# EAGLE design 1x9 to 1x9 (EAGLE 6.4)
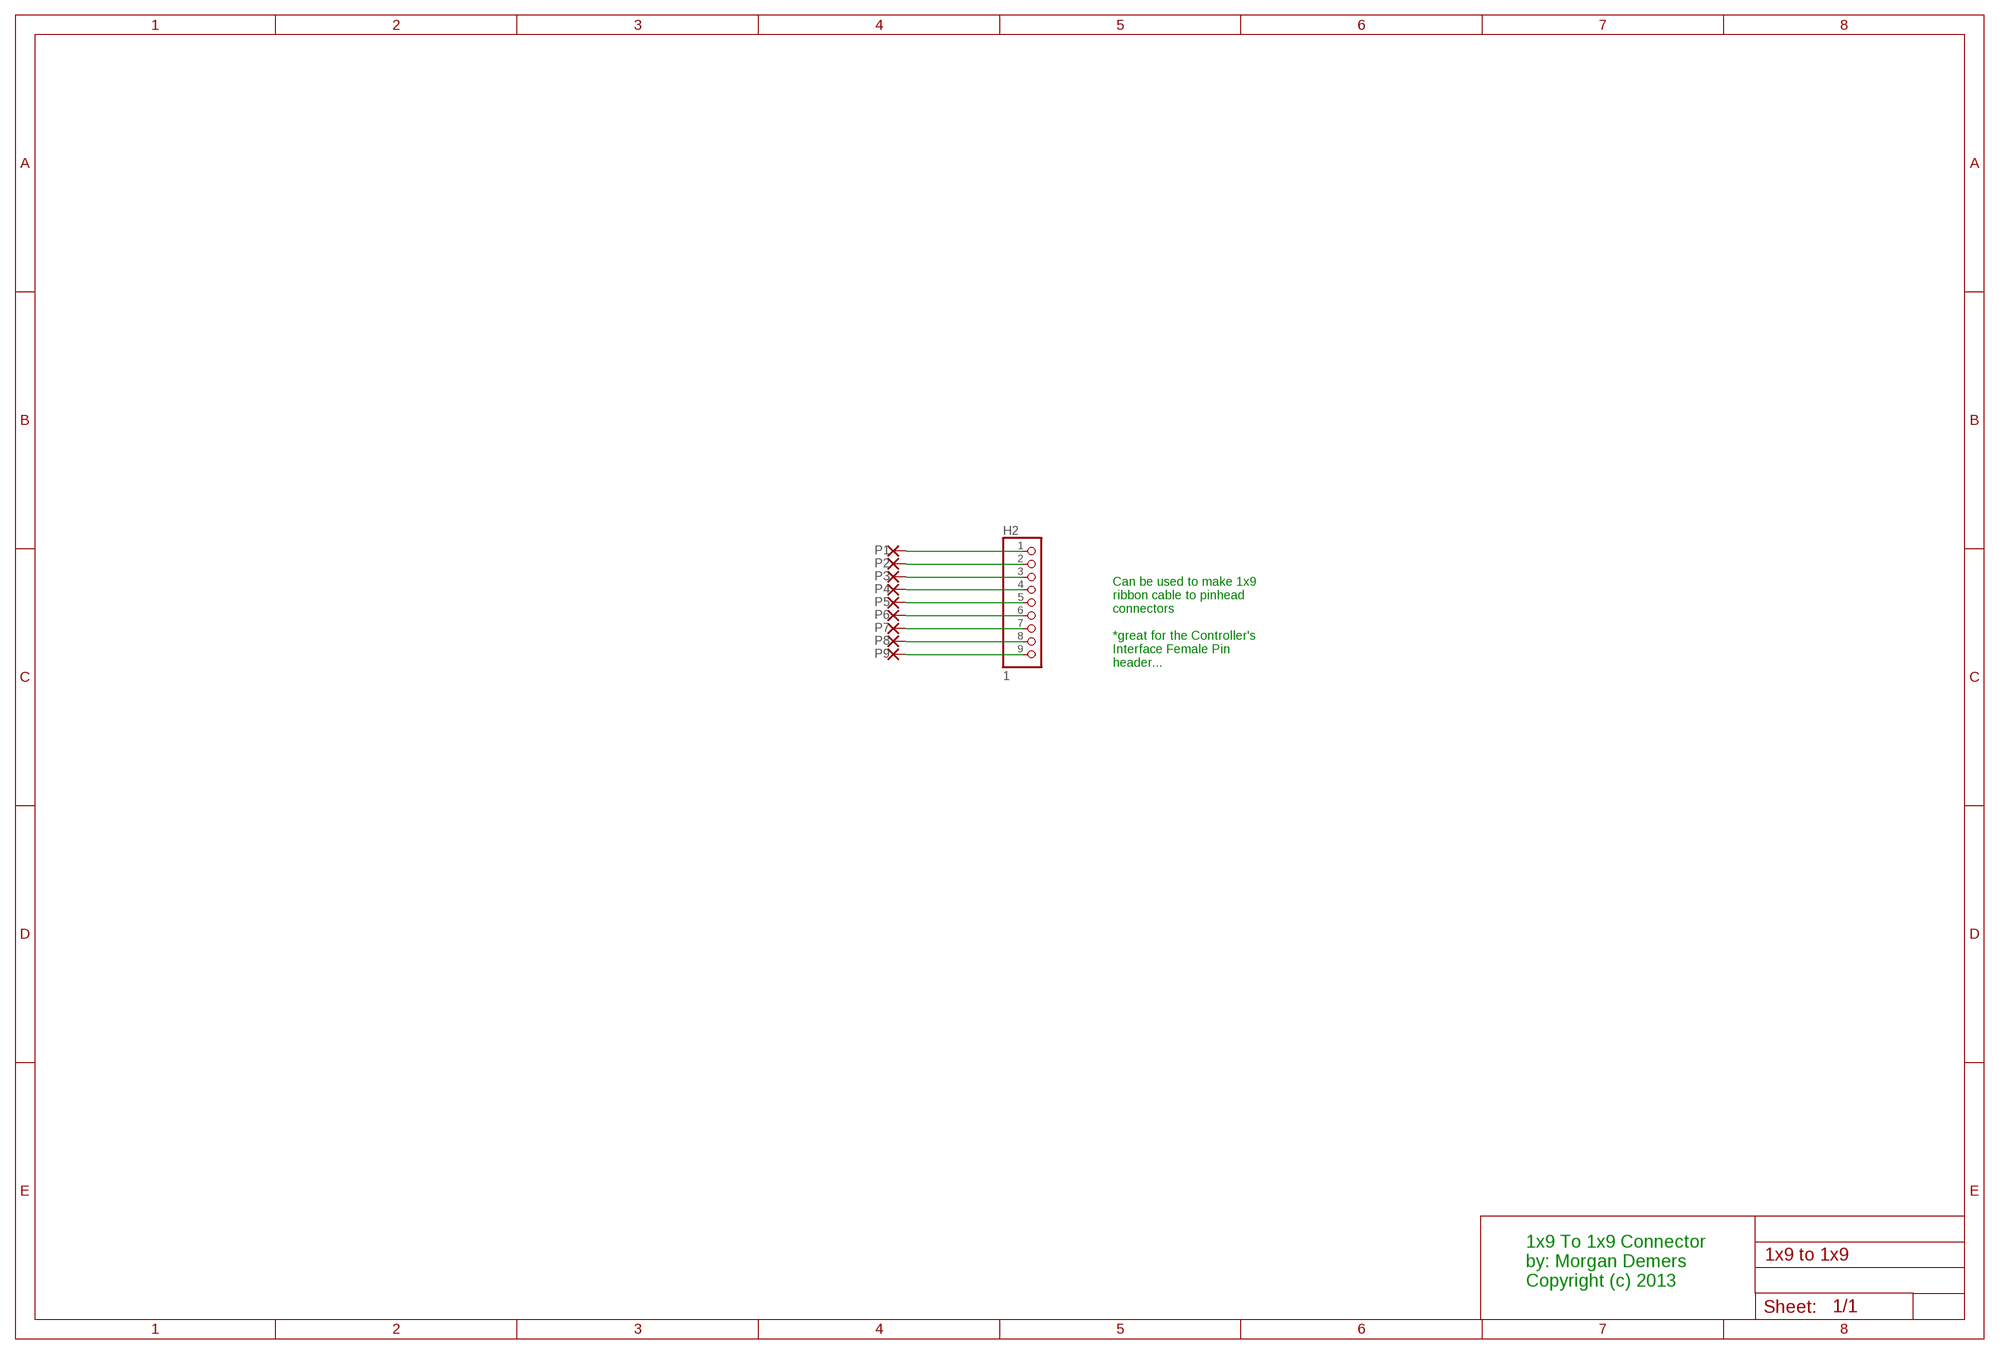
[diagram p0: schematic, sheet 1]

## Parts
H2  1  PINHD-1X9  [1X09]
P1  1,6/0,9  [1,6/0,9]
P2  1,6/0,9  [1,6/0,9]
P3  1,6/0,9  [1,6/0,9]
P4  1,6/0,9  [1,6/0,9]
P5  1,6/0,9  [1,6/0,9]
P6  1,6/0,9  [1,6/0,9]
P7  1,6/0,9  [1,6/0,9]
P8  1,6/0,9  [1,6/0,9]
P9  1,6/0,9  [1,6/0,9]

## Nets
S$1: H2.1 P1.1(P)
S$2: H2.2 P2.1(P)
S$3: H2.3 P3.1(P)
S$4: H2.4 P4.1(P)
S$5: H2.5 P5.1(P)
S$6: H2.6 P6.1(P)
S$7: H2.7 P7.1(P)
S$8: H2.8 P8.1(P)
S$9: H2.9 P9.1(P)

## Notes on the sheet
- Can be used to make 1x9
  ribbon cable to pinhead
  connectors
  
  *great for the Controller's
  Interface Female Pin
  header...
- 1x9 To 1x9 Connector
  by: Morgan Demers
  Copyright (c) 2013

## Library data of the parts
H2 = pinhead:PINHD-1X9: PIN HEADER
P1-P9 = wirepad:1,6/0,9: THROUGH-HOLE PAD

## Board
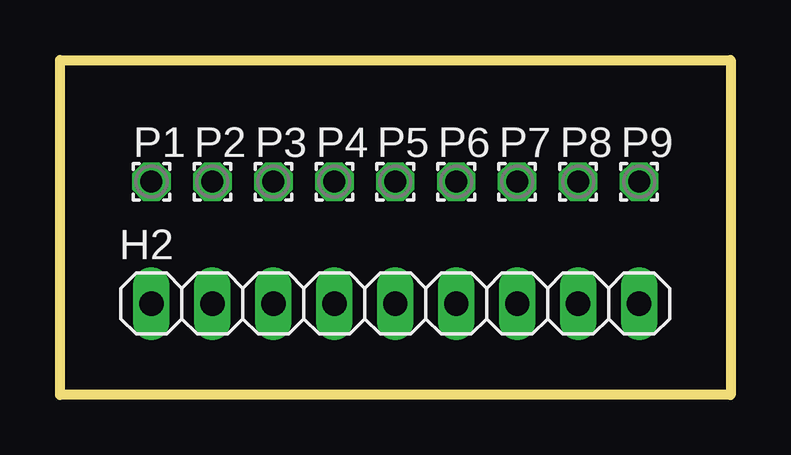
[diagram p1: board, top side]
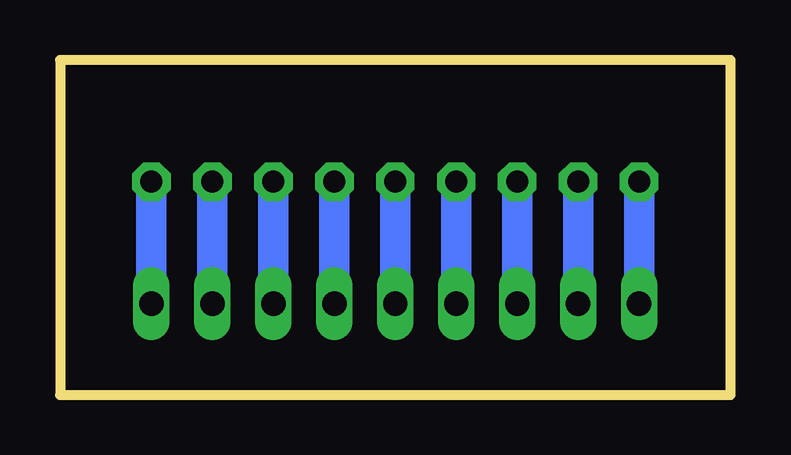
[diagram p2: board, bottom side, seen from below]

Size 27.94 x 13.97 mm. Coordinates in mm from the lower left corner, seen from the top.
Outline: 0,0 0,13.97 27.94,13.97 27.94,0 0,0
Copper layers (1*16): Top 0.035mm / dielectric 1.5mm / Bottom 0.035mm
Design rules "default": minimum track width 10mil, minimum drill 24mil, track to track 8mil, track to pad 8mil, pad to pad 8mil, via to via 8mil, smd to smd 8mil, copper to edge 40mil, drill to drill 8mil, minimum pad ring 10mil, minimum via ring 8mil, stop-mask expansion 4mil, vias tented up to drill 0mil, thermal gap 10mil

### Footprints (pad centres in the part's own frame; a part is rotated, then mirrored left to right if it is on the bottom)
1X09 = drill 1.016 long: 1 -10.16,0; 2 -7.62,0; 3 -5.08,0; 4 -2.54,0; 5 0,0; 6 2.54,0; 7 5.08,0; 8 7.62,0; 9 10.16,0
1,6/0,9 = drill 0.914 pad 1.6 octagon: 1 0,0

### Placement (x,y rotation side)
H2  13.97,3.81 0 top
P1  3.81,8.89 0 top
P2  6.35,8.89 0 top
P3  8.89,8.89 0 top
P4  11.43,8.89 0 top
P5  13.97,8.89 0 top
P6  16.51,8.89 0 top
P7  19.05,8.89 0 top
P8  21.59,8.89 0 top
P9  24.13,8.89 0 top

### Tracks (layer width: path | path; a pad name or v marks a point on that pad's centre or on a via)
S$1
  Bottom 1.27: P1.1 H2.1
S$2
  Bottom 1.27: P2.1 H2.2
S$3
  Bottom 1.27: P3.1 H2.3
S$4
  Bottom 1.27: P4.1 H2.4
S$5
  Bottom 1.27: P5.1 H2.5
S$6
  Bottom 1.27: P6.1 H2.6
S$7
  Bottom 1.27: P7.1 H2.7
S$8
  Bottom 1.27: P8.1 H2.8
S$9
  Bottom 1.27: P9.1 H2.9

### Text on the board
tDocu: 1x9 ribbon to 1x9 header | by Morgan Demers | 9